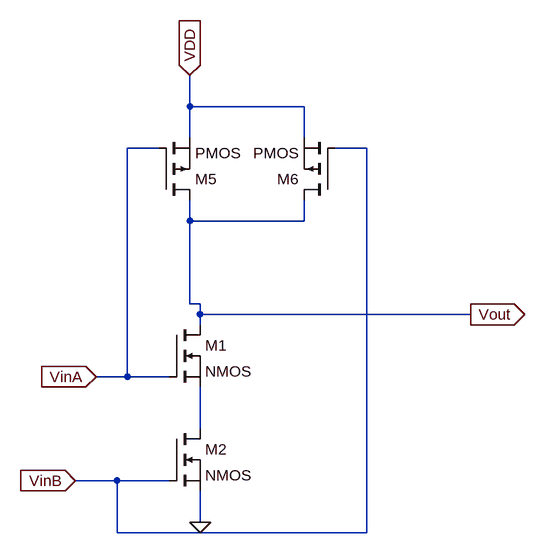
[diagram p0: schematic CMOSNAND.asc]
CMOSNAND.asc, the LTspice schematic file:
Version 4
SHEET 1 880 680
WIRE 128 -208 128 -256
WIRE 304 -208 128 -208
WIRE 128 -160 128 -208
WIRE 304 -160 304 -208
WIRE 80 -144 32 -144
WIRE 400 -144 352 -144
WIRE 128 -32 128 -64
WIRE 304 -32 304 -64
WIRE 304 -32 128 -32
WIRE 128 96 128 -32
WIRE 144 96 128 96
WIRE 144 112 144 96
WIRE 560 112 144 112
WIRE 144 128 144 112
WIRE 32 208 32 -144
WIRE 32 208 -16 208
WIRE 96 208 32 208
WIRE 144 288 144 224
WIRE 16 368 -48 368
WIRE 96 368 16 368
WIRE 144 432 144 384
WIRE 16 448 16 368
WIRE 400 448 400 -144
WIRE 400 448 16 448
FLAG 144 432 0
FLAG 560 112 Vout
IOPIN 560 112 Out
FLAG -16 208 VinA
IOPIN -16 208 In
FLAG -48 368 VinB
IOPIN -48 368 In
FLAG 128 -256 VDD
IOPIN 128 -256 In
SYMBOL nmos 96 128 R0
SYMATTR InstName M1
SYMBOL nmos 96 288 R0
SYMATTR InstName M2
SYMBOL pmos 80 -64 M180
SYMATTR InstName M5
SYMBOL pmos 352 -64 R180
SYMATTR InstName M6

The netlist it stands for:
* CMOSNAND.asc
M1 Vout VinA N001 N001 NMOS
M2 N001 VinB 0 0 NMOS
M5 Vout VinA VDD VDD PMOS
M6 Vout VinB VDD VDD PMOS
.model NMOS NMOS
.model PMOS PMOS
.lib standard.mos
.backanno
.end